# EasyEDA Pro project ProPrj_Glasses_v2.0_2025-07-16.epro

# Schematic Schematic1
Board Name: Board1; Create Date: 2025-03-25; Page Name: P1; Project Name: SmartEyes_v1.0; Schematic Name: Schematic1; Update Date: 2025-03-27; Company: 嘉立创EDA; Page Size: A3; Version: V1.0
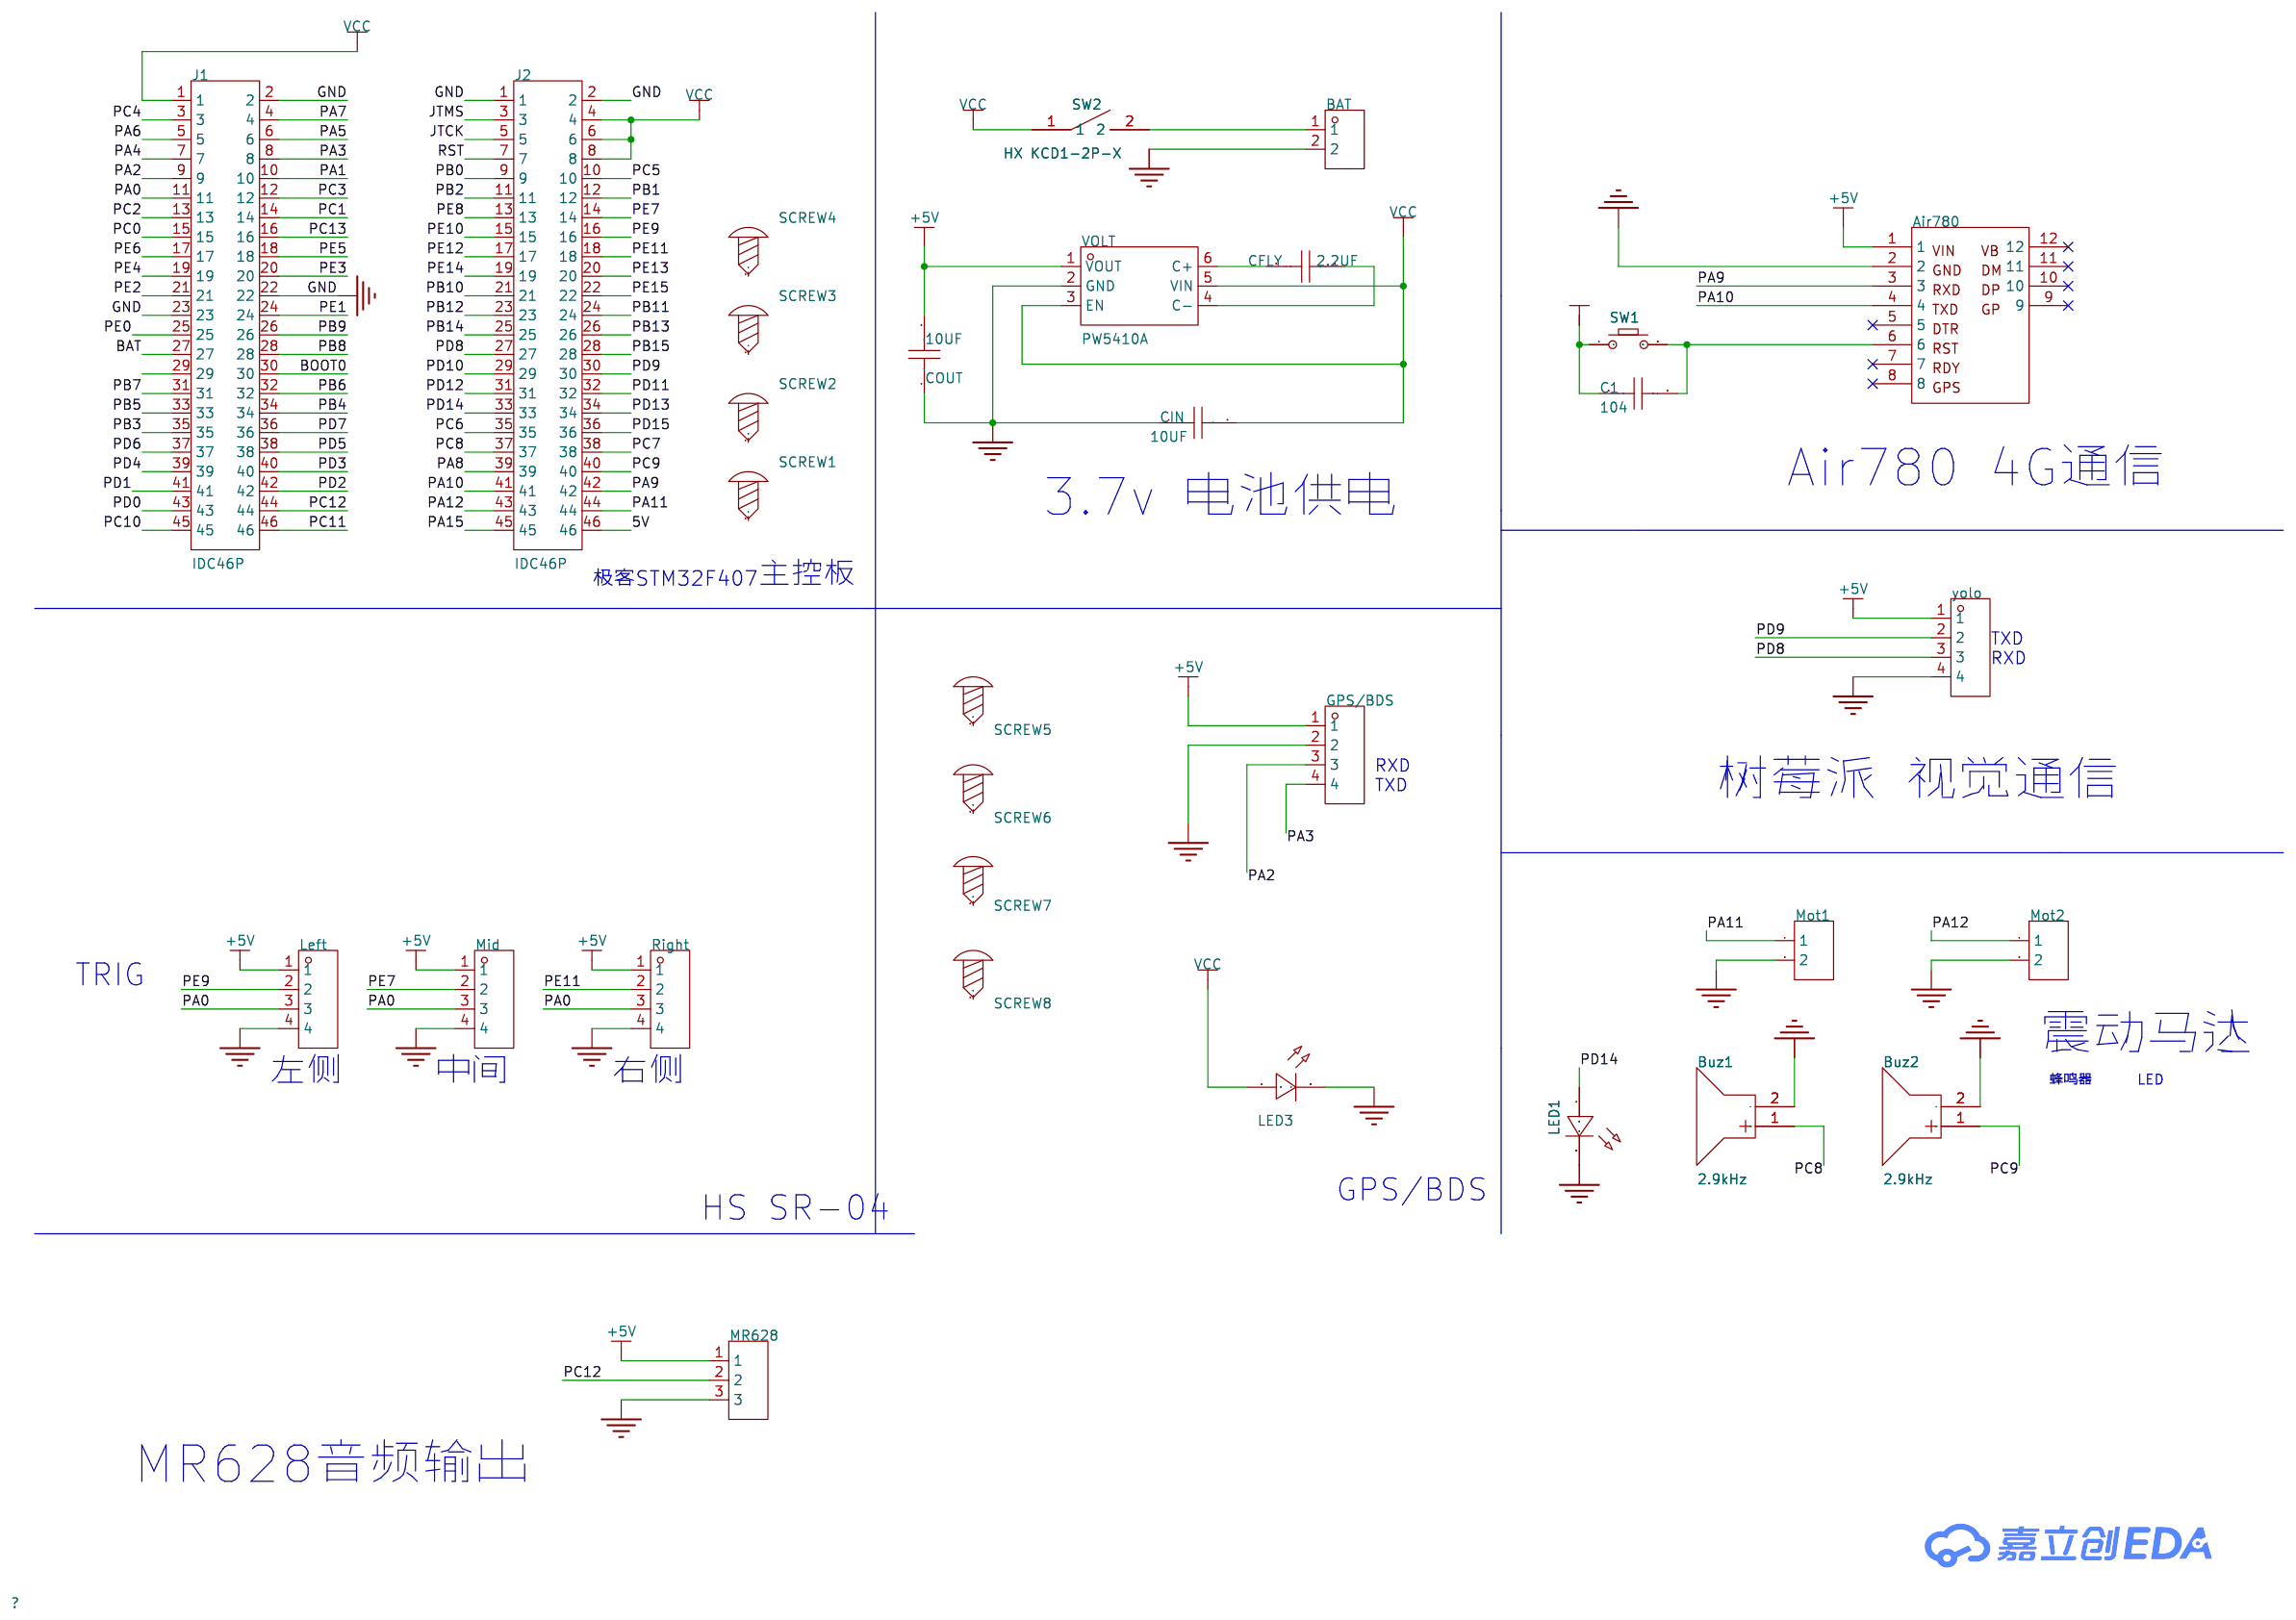
[diagram p0: schematic sheet]

## Parts
Air780  -  [AIR780-EG]
BAT  BAT  [CONN-TH_2P-P2.00_BOSSIE_BX-PH2.0-2PZZ]
Buz1  2.9kHz  [BUZ-TH_BD9.0-P5.00-D0.6-FD]
Buz2  2.9kHz  [BUZ-TH_BD9.0-P5.00-D0.6-FD]
C1  104  [C0603]
CFLY  2.2UF  [C0603]
CIN  10UF  [C0603]
COUT  10UF  [C0603]
GPS/BDS  -  [HDR-TH_4P-P2.54-V-F]
J1  IDC46P  [IDC46P2.54]
J2  IDC46P  [IDC46P2.54]
LED1  -  [LED_TH-3mm]
LED3  -  [LED_TH-3mm]
Left  -  [HDR-TH_4P-P2.54-V-F]
Mid  -  [HDR-TH_4P-P2.54-V-F]
Mot1  -  [HDR-TH_2P-P2.54-V-F]
Mot2  -  [HDR-TH_2P-P2.54-V-F]
MR628  -  [HDR-TH_3P-P2.54-V-F]
Right  -  [HDR-TH_4P-P2.54-V-F]
SCREW1  -  [M2螺丝]
SCREW2  -  [M2螺丝]
SCREW3  -  [M2螺丝]
SCREW4  -  [M2螺丝]
SCREW5  -  [M2螺丝]
SCREW6  -  [M2螺丝]
SCREW7  -  [M2螺丝]
SCREW8  -  [M2螺丝]
SW1  -  [Key_TH_3.5x6x4.3]
SW2  HX KCD1-2P-X  [SW-TH_L22.2-W15.0-P7.00_KCD1-2P-P]
VOLT  PW5410A  [SOT-23-6_L2.9-W1.6-P0.95-LS2.8-BL]
yolo  -  [HDR-TH_4P-P2.54-V-F]

## Library data of the parts
Air780 = AIR780
BAT = PH2.0-2P: Supplier Part: C9900095162; Supplier: LCSC
Buz1 Buz2 = HYT-0903: 频率:2.9kHz;声压(SPL):85dB;; LCSC Part Name: 有源蜂鸣器; Supplier Part: C7544822; Manufacturer: HYDZ(华宇); Supplier Footprint: DIP; JLCPCB Part Class: 扩展库; Datasheet: https://atta.szlcsc.com/upload/public/pdf/source/20230825/A312E5F617DF13E3AAE22AD81C6BF735.pdf; Supplier: LCSC; Current Consumption: 30mA; Sound Pressure Level(SPL): 85dB
C1 CFLY CIN COUT = CAP_0603: Supplier Footprint: 0603
GPS/BDS Left Mid Right yolo = HDR-F_2.54_1x4P: Supplier Part: C2718488; Supplier Footprint: 插件
J1 J2 = IDC46P
LED1 = LED_TH-R_3mm: Supplier Footprint: 插件
LED3 = LED_TH-G_3mm: Supplier Footprint: 插件
Mot1 Mot2 = HDR-F_2.54_1x2P: Supplier Part: C49661; Supplier Footprint: 插件
MR628 = HDR-F_2.54_1x3P: Supplier Part: C541850; Supplier Footprint: 插件
SCREW1-SCREW8 = M2螺丝: Supplier Footprint: 插件
SW1 = Key_TH_3.5x6x4.3: Supplier Footprint: 插件
SW2 = HX KCD1-2P-X: 带灯:无;引脚样式:焊片;额定电流:6A;额定电压(AC):250V;电路结构:单刀单掷;机械寿命:1万次;; LCSC Part Name: 15*21mm 两脚两档跷板开关 斜面 黑; Supplier Part: C6917320; Manufacturer: hanxia(韩下); Supplier Footprint: 插件; JLCPCB Part Class: 扩展库; Datasheet: https://atta.szlcsc.com/upload/public/pdf/source/20230526/4AB23C3AD7E65E499A88CF86328E83B0.pdf; Supplier: LCSC; With Lamp: 无; Pin Style: 焊片; Actuator Color: 黑色; Contact Current: 6A; Voltage Rating (AC): 250V; Circuit: 单刀单掷; Mechanical Life: 1万次
VOLT = PW5410A: Supplier Part: C9900093484; Supplier Footprint: SOT23-6L; JLCPCB Part Class: 扩展库; Supplier: LCSC

## Nets
5V: J2.46
+3.3V: C1.1 SW1.A
+5V: Air780.1 COUT.2 GPS/BDS.1 Left.1 Mid.1 MR628.1 Right.1 VOLT.1(VOUT) yolo.1
GND: Air780.2 BAT.2 Buz1.2(-) Buz2.2(-) CIN.1 COUT.1 GPS/BDS.2 J1.2 J1.22 J1.23 J2.1 J2.2 LED1.2(A) LED3.2(A) Left.4 Mid.4 Mot1.2 Mot2.2 MR628.3 Right.4 VOLT.2(GND) yolo.4
VCC: CIN.2 J1.1 J2.4 J2.6 J2.8 LED3.1(C) SW2.1 VOLT.3(EN) VOLT.5(VIN)
BAT: J1.27
BOOT0: J1.30
JTCK: J2.5
JTMS: J2.3
PA0: J1.11 Left.3 Mid.3 Right.3
PA1: J1.10
PA2: GPS/BDS.3 J1.9
PA3: GPS/BDS.4 J1.8
PA4: J1.7
PA5: J1.6
PA6: J1.5
PA7: J1.4
PA8: J2.39
PA9: Air780.3 J2.42
PA10: Air780.4 J2.41
PA11: J2.44 Mot1.1
PA12: J2.43 Mot2.1
PA15: J2.45
PB0: J2.9
PB1: J2.12
PB2: J2.11
PB3: J1.35
PB4: J1.34
PB5: J1.33
PB6: J1.32
PB7: J1.31
PB8: J1.28
PB9: J1.26
PB10: J2.21
PB11: J2.24
PB12: J2.23
PB13: J2.26
PB14: J2.25
PB15: J2.28
PC0: J1.15
PC1: J1.14
PC2: J1.13
PC3: J1.12
PC4: J1.3
PC5: J2.10
PC6: J2.35
PC7: J2.38
PC8: Buz1.1(+) J2.37
PC9: Buz2.1(+) J2.40
PC10: J1.45
PC11: J1.46
PC12: J1.44 MR628.2
PC13: J1.16
PD0: J1.43
PD1: J1.41
PD2: J1.42
PD3: J1.40
PD4: J1.39
PD5: J1.38
PD6: J1.37
PD7: J1.36
PD8: J2.27 yolo.3
PD9: J2.30 yolo.2
PD10: J2.29
PD11: J2.32
PD12: J2.31
PD13: J2.34
PD14: J2.33 LED1.1(C)
PD15: J2.36
PE0: J1.25
PE1: J1.24
PE2: J1.21
PE3: J1.20
PE4: J1.19
PE5: J1.18
PE6: J1.17
PE7: J2.14 Mid.2
PE8: J2.13
PE9: J2.16 Left.2
PE10: J2.15
PE11: J2.18 Right.2
PE12: J2.17
PE13: J2.20
PE14: J2.19
PE15: J2.22
RST: J2.7
$1N1394: Air780.6 C1.2 SW1.B
$1N4123: BAT.1 SW2.2
$1N7561: CFLY.1 VOLT.6(C+)
$1N7565: CFLY.2 VOLT.4(C-)

Not connected (* = marked no-connect by the designer): Air780 5* 7* 8* 9* 10* 11* 12*; J1 29; SCREW1 1; SCREW2 1; SCREW3 1; SCREW4 1; SCREW5 1; SCREW6 1; SCREW7 1; SCREW8 1

## Notes on the sheet
- Air780 4G通信
- 3.7v 电池供电
- 极客STM32F407
- 主控板
- RXD
- TXD
- RXD
- TXD
- 树莓派 视觉通信
- TRIG
- 震动马达
- 左侧
- 中间
- 右侧
- 蜂鸣器
- LED
- HS SR-04
- GPS/BDS
- MR628音频输出

# Board PCB1
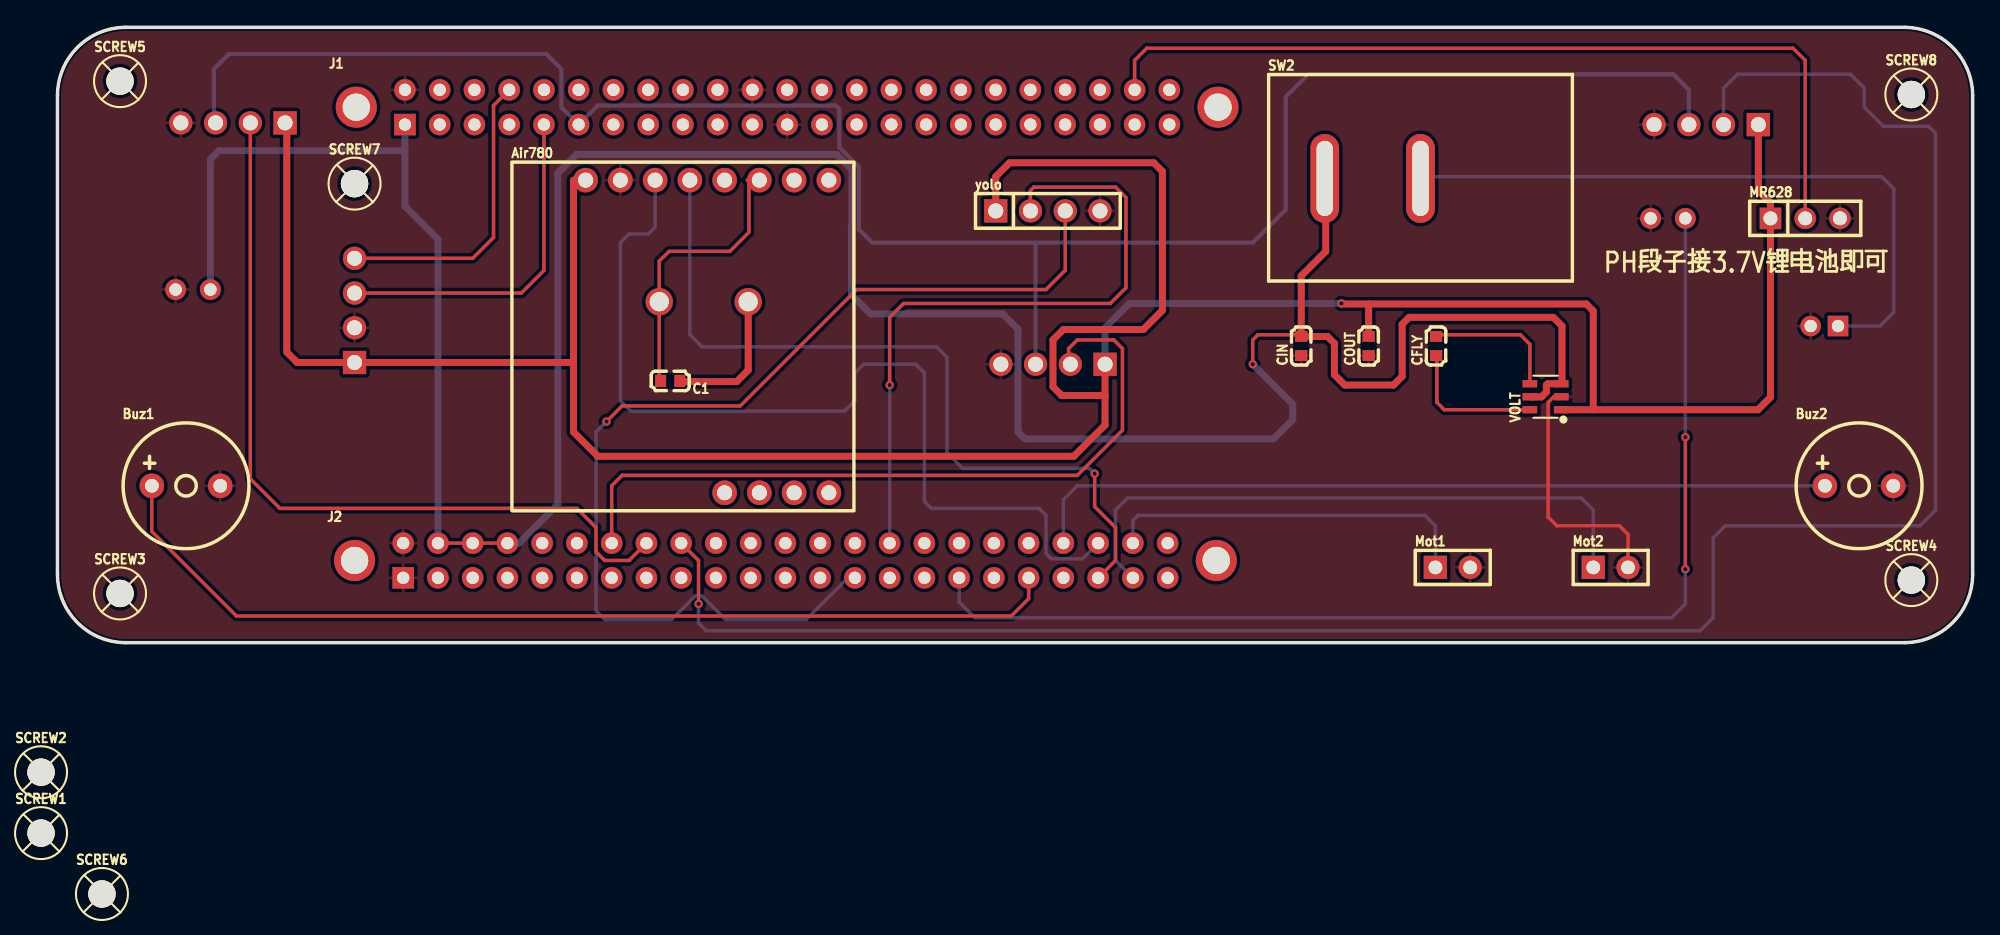
[diagram p1: board, top side]
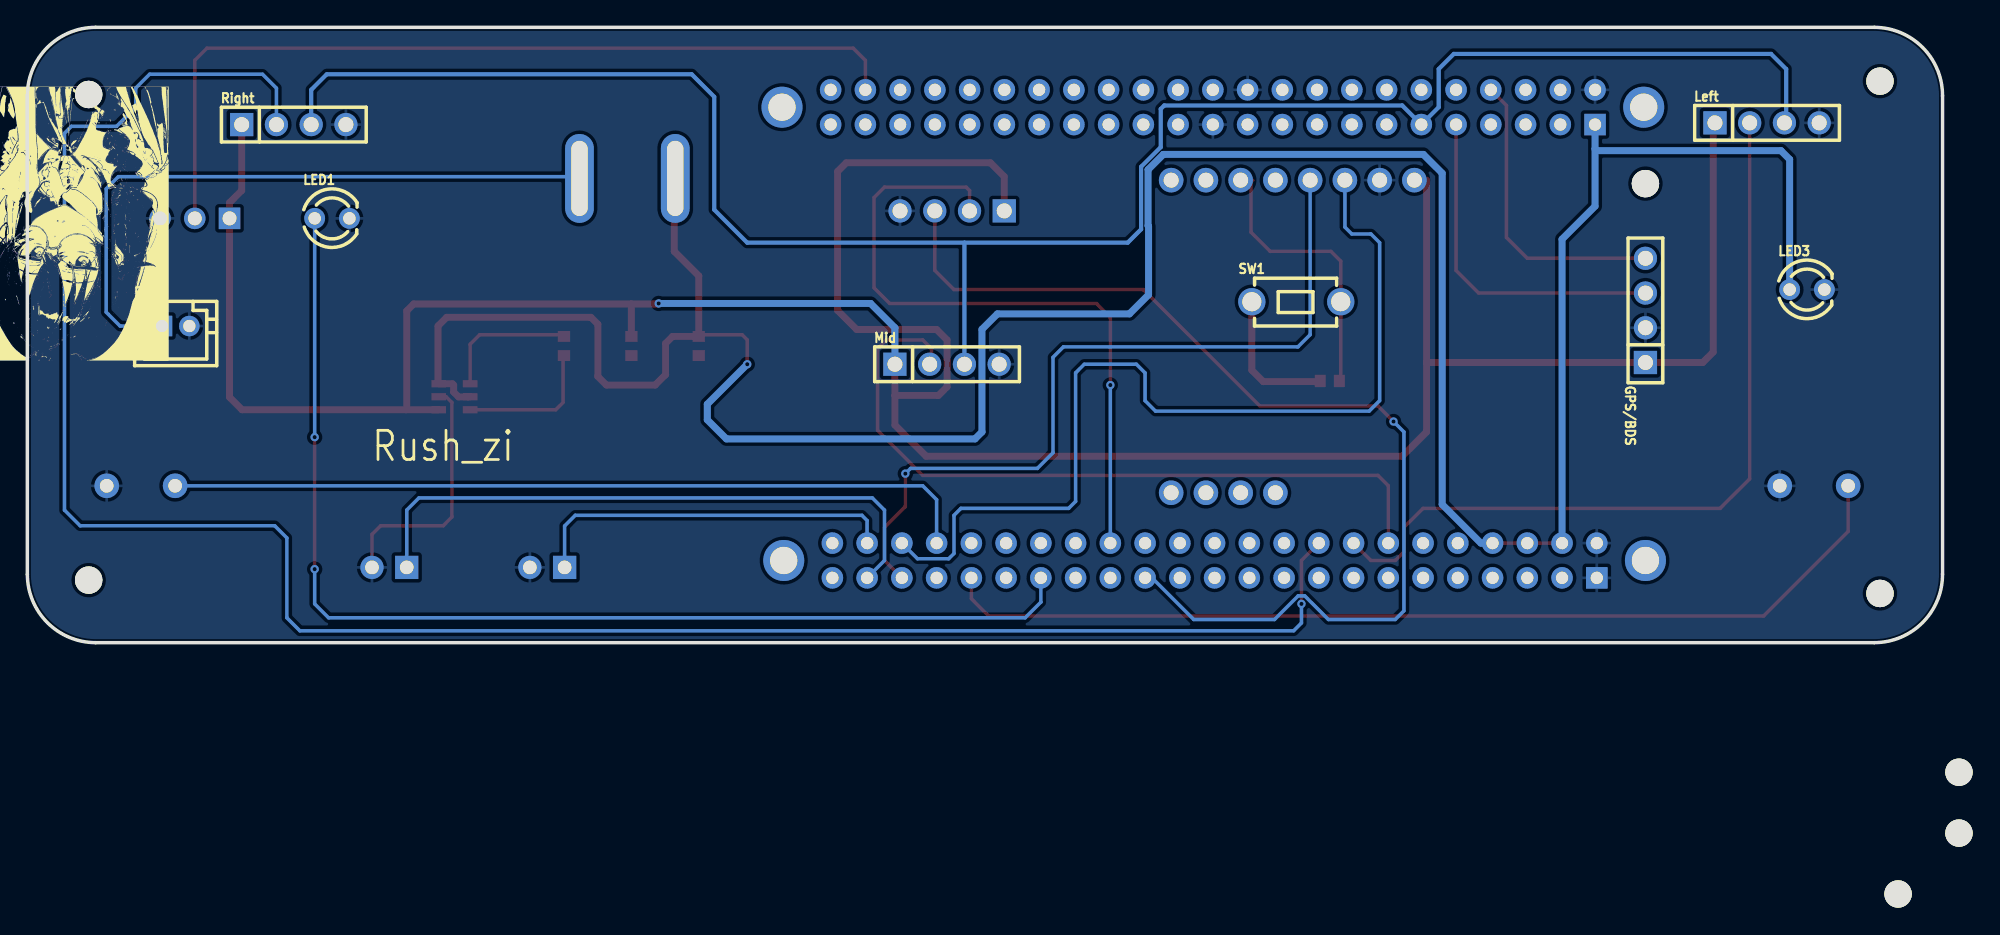
[diagram p2: board, bottom side, seen from below]

Outline 140 x 45 mm; copper layers: Top Layer, Bottom Layer. Coordinates in mm from the lower left corner of the outline.
Outline path: 0,40 0,5 arc(1.46,1.46) 5,0 135,0 arc(138.54,1.46) 140,5 140,40 arc(138.54,43.54) 135,45 5,45 arc(1.46,43.54) 0,40
Stack: Top Layer 0.035mm / Dielectric1 1.51mm FR4 er 4.5 / Bottom Layer 0.035mm

## Design rules (mm)
template: JLCPCB Capability(Two Layers Board)
spacing copperThickness1oz (default): track to track 0.102, other pairs 0.152 to 0.3
spacing copperThickness2oz: track to track 0.203, other pairs 0.152 to 0.3
track width copperThickness1oz (default): min 0.127, default 0.254, max 2.54
track width copperThickness2oz: min 0.203, default 0.254, max 2.54
differential pair differentialPair (default): width min 0.127, default 0.254, max 2.54; gap min 0.152, default 0.152
via viaSize (default): diameter min 0.5, default 0.61, max 10; hole min 0.3, default 0.305, max 6.3

## Placement (name value [footprint] x y rotation side)
Air780  -  [AIR780-EG]  45.72 22.39 0 top
BAT  BAT  [CONN-TH_2P-P2.00_BOSSIE_BX-PH2.0-2PZZ]  129.16 23.16 180 bottom
Buz1  2.9kHz  [BUZ-TH_BD9.0-P5.00-D0.6-FD]  9.4 11.47 0 top
Buz2  2.9kHz  [BUZ-TH_BD9.0-P5.00-D0.6-FD]  131.7 11.47 0 top
C1  104  [C0603]  44.79 19.14 180 top
CFLY  2.2UF  [C0603]  100.78 21.69 90 top
CIN  10UF  [C0603]  90.92 21.69 90 top
COUT  10UF  [C0603]  95.85 21.69 90 top
GPS/BDS  -  [HDR-TH_4P-P2.54-V-F]  21.72 24.3 90 bottom
J1  IDC46P  [IDC46P2.54]  25.4 37.89 0 top
J2  IDC46P  [IDC46P2.54]  25.27 4.74 0 top
LED1  -  [LED_TH-3mm]  117.73 31.03 180 bottom
LED3  -  [LED_TH-3mm]  9.91 25.82 180 bottom
Left  -  [HDR-TH_4P-P2.54-V-F]  12.83 38.02 180 bottom
Mid  -  [HDR-TH_4P-P2.54-V-F]  72.77 20.36 180 bottom
Mot1  -  [HDR-TH_2P-P2.54-V-F]  102 5.5 0 top
Mot2  -  [HDR-TH_2P-P2.54-V-F]  113.54 5.5 0 top
MR628  -  [HDR-TH_3P-P2.54-V-F]  127.76 31.03 0 top
Right  -  [HDR-TH_4P-P2.54-V-F]  120.52 37.89 180 bottom
SCREW1  -  [M2螺丝]  -1.2 -13.93 0 top
SCREW2  -  [M2螺丝]  -1.2 -9.48 0 top
SCREW3  -  [M2螺丝]  4.57 3.6 0 top
SCREW4  -  [M2螺丝]  135.52 4.57 0 top
SCREW5  -  [M2螺丝]  4.57 41.07 0 top
SCREW6  -  [M2螺丝]  3.25 -18.38 0 top
SCREW7  -  [M2螺丝]  21.72 33.57 0 top
SCREW8  -  [M2螺丝]  135.52 40.09 0 top
SW1  -  [Key_TH_3.5x6x4.3]  47.41 24.93 180 bottom
SW2  HX KCD1-2P-X  [SW-TH_L22.2-W15.0-P7.00_KCD1-2P-P]  96.14 33.95 0 top
VOLT  PW5410A  [SOT-23-6_L2.9-W1.6-P0.95-LS2.8-BL]  108.78 17.98 90 top
yolo  -  [HDR-TH_4P-P2.54-V-F]  72.4 31.58 0 top

## Footprints (pads in the part's own frame, mm; a bottom-side part is the same pattern mirrored in y, then rotated)
AIR780-EG
  round 1.8 hole 1.1: 1(-7.112,11.43) 2(-4.572,11.43) 3(-2.032,11.43) 4(0.508,11.43) 5(3.048,11.43) 6(5.588,11.43) 7(8.128,11.43) 8(10.668,11.43) 9(3.048,-11.43) 10(5.588,-11.43) 11(8.128,-11.43) 12(10.668,-11.43)
BUZ-TH_BD9.0-P5.00-D0.6-FD
  round 1.8 hole 1: 1(-2.5,0) 2(2.5,0)
C0603
  rect 0.8x0.9 smd: 1(-0.7,0) 2(0.7,0)
CONN-TH_2P-P2.00_BOSSIE_BX-PH2.0-2PZZ
  rect 1.5x1.5 hole 0.9: 1(-1,0)
  round 1.5 hole 0.9: 2(1,0)
HDR-TH_2P-P2.54-V-F
  rect 1.7x1.7 hole 1: 1(-1.27,0)
  round 1.7 hole 1: 2(1.27,0)
HDR-TH_3P-P2.54-V-F
  rect 1.575x1.575 hole 1.02: 1(-2.54,0)
  round 1.575 hole 1.02: 2(0,0) 3(2.54,0)
HDR-TH_4P-P2.54-V-F
  rect 1.7x1.7 hole 1.1: 1(-3.81,0)
  round 1.7 hole 1.1: 2(-1.27,0) 3(1.27,0) 4(3.81,0)
IDC46P2.54
  round 3 hole 2: 0(-3.556,1.27) 0(59.436,1.27)
  rect 1.575x1.575 hole 0.9: 1(0,0)
  round 1.575 hole 0.9: 2(0,2.54) 3(2.54,0) 4(2.54,2.54) 5(5.08,0) 6(5.08,2.54) 7(7.62,0) 8(7.62,2.54) 9(10.16,0) 10(10.16,2.54) 11(12.7,0) 12(12.7,2.54) 13(15.24,0) 14(15.24,2.54) 15(17.78,0) 16(17.78,2.54) 17(20.32,0) 18(20.32,2.54) 19(22.86,0) 20(22.86,2.54) 21(25.4,0) 22(25.4,2.54) 23(27.94,0) 24(27.94,2.54) 25(30.48,0) 26(30.48,2.54) 27(33.02,0) 28(33.02,2.54) 29(35.56,0) 30(35.56,2.54) 31(38.1,0) 32(38.1,2.54) 33(40.64,0) 34(40.64,2.54) 35(43.18,0) 36(43.18,2.54) 37(45.72,0) 38(45.72,2.54) 39(48.26,0) 40(48.26,2.54) 41(50.8,0) 42(50.8,2.54) 43(53.34,0) 44(53.34,2.54) 45(55.88,0) 46(55.88,2.54)
Key_TH_3.5x6x4.3
  round 1.999 hole 1.399: A(-3.084,0) B(3.416,0)
LED_TH-3mm
  round 1.524 hole 0.914: 1(-1.27,0) 2(1.27,0)
M2螺丝
  round 2 hole 2: 1(0,0)
SOT-23-6_L2.9-W1.6-P0.95-LS2.8-BL
  rect 0.532x1.072 smd: 1(-0.95,-1.149) 2(0,-1.149) 3(0.95,-1.149) 4(0.95,1.149) 5(0,1.149) 6(-0.95,1.149)
SW-TH_L22.2-W15.0-P7.00_KCD1-2P-P
  oval 2.1x6.5 hole 1.2x5.5: 1(-3.5,0) 2(3.5,0)

## Nets
As in the schematic.

Pads without a net: Air780 5 7 8 9 10 11 12; J1 0; J2 0; SCREW1 1; SCREW2 1; SCREW3 1; SCREW4 1; SCREW5 1; SCREW6 1; SCREW7 1; SCREW8 1

## Via types
v1: diameter 0.61, hole 0.305, Top Layer to Bottom Layer, 8 vias

## Routing (per net, layer and track width the routed paths; a pad name or vN(x,y) marks a point on that pad's centre or on a via; arc(x,y) is an arc through that point)
+3.3V: length 10.4
  Top Layer w0.508: C1.1 45.54,19.09 49.66,19.09 50.49,19.93 SW1.A
+5V: length 228.3
  Top Layer w0.508: v1(93.85,24.81) 93.89,24.77 95.85,24.77 ; 37.72,20.49 37.72,15.41 39.5,13.63 74.29,13.63 76.58,15.92 76.58,18.08 ; 37.72,20.49 37.72,33.82 ; 37.72,20.49 GPS/BDS.1 17.53,20.49 16.76,21.25 16.76,37.89 Left.1 ; 112.29,17.03 112.27,17.06 112.27,24.26 111.76,24.77 95.85,24.77 ; 112.29,17.03 124.31,17.03 125.22,17.95 MR628.1 125.22,32.17 124.33,33.06 Right.1 ; 112.29,17.03 VOLT.1 ; 76.58,18.08 76.57,18.08 73.41,18.08 72.77,18.71 72.77,22.14 73.53,22.9 79.38,22.9 80.77,24.3 80.77,34.46 80.14,35.09 69.6,35.09 68.59,34.09 yolo.1 ; 76.58,18.08 Mid.1 ; 95.85,24.77 COUT.2
  Bottom Layer w0.508: Mid.1 76.58,23.03 78.36,24.81 v1(93.85,24.81)
GND: length 18.3
  Top Layer w0.254: Mot2.2 114.81,7.92 114.17,8.55 109.6,8.55 108.97,9.19 108.97,17.57 109.38,17.98 VOLT.2
VCC: length 219.9
  Top Layer w0.254: v1(87.38,20.36) 87.38,22.14 87.76,22.52 90.79,22.52 CIN.2 ; J2.4 J2.6 J2.8
  Top Layer w0.508: VOLT.5 107.76,17.98 107.77,17.97 108.48,17.97 108.84,18.33 108.84,18.84 108.94,18.94 VOLT.3 109.98,18.99 109.98,23.16 109.35,23.79 98.81,23.79 98.3,23.28 98.3,19.47 97.66,18.84 94.11,18.84 93.34,19.6 93.34,21.89 92.84,22.39 CIN.2 90.92,26.83 92.71,28.62 92.71,33.88 SW2.1
  Bottom Layer w0.508: J2.8 33.75,7.28 36.58,10.11 36.58,34.33 37.95,35.71 56.96,35.71 58.08,34.59 58.08,30.49 58.04,30.45 58.04,25.44 59.44,24.05 69.09,24.05 70.22,22.92 70.22,15.41 70.72,14.9 88.9,14.9 90.3,16.3 90.3,17.44 v1(87.38,20.36) ; LED3.1 11.18,35.35 11.81,35.98 25.27,35.98 25.4,36.11 ; J1.1 25.4,36.11 ; 25.4,36.11 25.4,31.92 27.81,29.51 J2.4
PA0: length 146.9
  Bottom Layer w0.305: 71.5,29.25 59.56,29.25 58.59,30.23 58.59,34.8 57.15,36.24 57.15,39.03 56.9,39.28 39.5,39.28 J1.11 36.83,39.16 36.83,41.95 35.73,43.06 12.53,43.06 11.43,41.95 11.43,38.14 Left.3 ; 71.5,29.25 Mid.3 ; 71.5,29.25 87.38,29.25 89.79,31.67 89.79,39.92 91.44,41.57 118.11,41.57 119.25,40.43 Right.3
PA2: length 25.2
  Top Layer w0.254: J1.9 35.56,27.22 33.91,25.57 GPS/BDS.3
PA3: length 22.1
  Top Layer w0.254: J1.8 31.88,39.29 31.88,29.63 30.35,28.11 21.72,28.11
PA9: length 69.4
  Bottom Layer w0.254: Air780.3 43.69,30.39 43.18,29.89 41.78,29.89 41.15,29.25 41.15,17.69 41.91,16.93 57.53,16.93 58.29,17.69 58.29,19.73 58.93,20.36 62.74,20.36 63.37,19.73 63.37,10.33 63.88,9.82 71.75,9.82 72.26,9.31 72.26,6.52 72.64,6.14 74.93,6.14 J2.42
PA10: length 58
  Top Layer w0.254: J2.41 77.34,6.01 77.34,8.42 75.82,9.95 v1(75.82,12.36)
  Bottom Layer w0.254: Air780.4 46.23,22.52 47.12,21.63 64.26,21.63 65.02,20.87 65.02,13.89 66.17,12.74 75.44,12.74 v1(75.82,12.36)
PA11: length 27.3
  Bottom Layer w0.254: Mot1.1 100.73,8.53 99.95,9.31 78.99,9.31 78.61,8.93 J2.44
PA12: length 45.3
  Bottom Layer w0.254: Mot2.1 112.27,9.69 111.38,10.58 78.23,10.58 77.34,9.69 77.34,6.01 J2.43
PC8: length 72
  Top Layer w0.254: Buz1.1 6.9,8.13 13.08,1.95 69.72,1.95 70.99,3.22 J2.37
PC9: length 59.3
  Bottom Layer w0.254: J2.40 73.53,10.46 74.55,11.47 Buz2.1
PC12: length 63.5
  Top Layer w0.254: J1.44 78.74,42.59 79.63,43.48 126.87,43.48 127.76,42.59 MR628.2
PD8: length 78.5
  Top Layer w0.254: yolo.3 73.67,27.23 72.26,25.82 58.42,25.82 49.91,17.31 41.28,17.31 v1(40.13,16.17)
  Bottom Layer w0.254: J2.27 57.78,4.74 54.74,1.69 48.83,1.69 47.11,3.42 46.62,3.42 44.89,1.69 40,1.69 39.37,2.33 39.37,15.41 v1(40.13,16.17)
PD9: length 50.2
  Top Layer w0.254: v1(60.83,18.84) 60.83,23.79 61.85,24.81 76.96,24.81 78.1,25.95 78.1,32.55 77.34,33.32 71.37,33.32 71.12,33.06 71.12,31.58 yolo.2
  Bottom Layer w0.254: J2.30 v1(60.83,18.84)
PD14: length 84
  Top Layer w0.254: v1(119,15.03) v1(119,5.38)
  Bottom Layer w0.254: J2.33 65.91,2.96 67.06,1.82 117.98,1.82 119,2.84 v1(119,5.38) ; LED1.1 v1(119,15.03)
PE7: length 54.8
  Top Layer w0.254: J2.14 40.51,11.47 41.28,12.23 74.55,12.23 77.85,15.54 77.85,21.5 77.22,22.14 74.55,22.14 73.91,21.5 73.91,20.49 Mid.2
PE9: length 59
  Top Layer w0.254: Left.2 14.1,11.98 16.26,9.82 37.97,9.82 39.37,8.42 39.37,6.65 40,6.01 41.78,6.01 J2.16
PE11: length 152.9
  Top Layer w0.254: J2.18 46.86,6.01 v1(46.86,2.84)
  Bottom Layer w0.254: Right.2 121.79,40.56 122.81,41.57 131.06,41.57 132.08,40.56 132.08,39.16 133.48,37.76 136.78,37.76 137.29,37.25 137.29,9.69 136.14,8.55 121.92,8.55 121.03,7.66 121.03,1.82 120.08,0.87 47.43,0.87 46.86,1.44 v1(46.86,2.84)
$1N1394: length 20.1
  Top Layer w0.254: 50.42,33.82 50.55,33.7 50.55,30.01 49.15,28.62 44.7,28.62 43.99,27.91 SW1.B 43.99,19.24 C1.2
$1N4123: length 48.5
  Bottom Layer w0.254: BAT.1 133.22,23.16 134.24,24.17 134.24,33.19 133.35,34.08 99.77,34.08 SW2.2
$1N7561: length 10.5
  Top Layer w0.254: CFLY.1 100.84,20.93 100.84,17.57 101.37,17.03 VOLT.6
$1N7565: length 10.1
  Top Layer w0.254: CFLY.2 100.9,22.52 106.93,22.52 107.63,21.82 VOLT.4

## Copper pours and planes (outline as drawn; the poured copper is in the pictures)
GND on Top Layer: -2.79,47.54 143.26,47.54 143.26,-2.12 -2.79,-2.12
GND on Bottom Layer: -1.78,47.54 141.73,47.54 141.73,-1.74 -1.78,-1.74

## Text on the board
Bottom Silkscreen Layer: Rush_zi
Top Silkscreen Layer: PH段子接3.7V锂电池即可
